# EAGLE schematic matchbox_cpu_v11 (EAGLE 7.2.0)
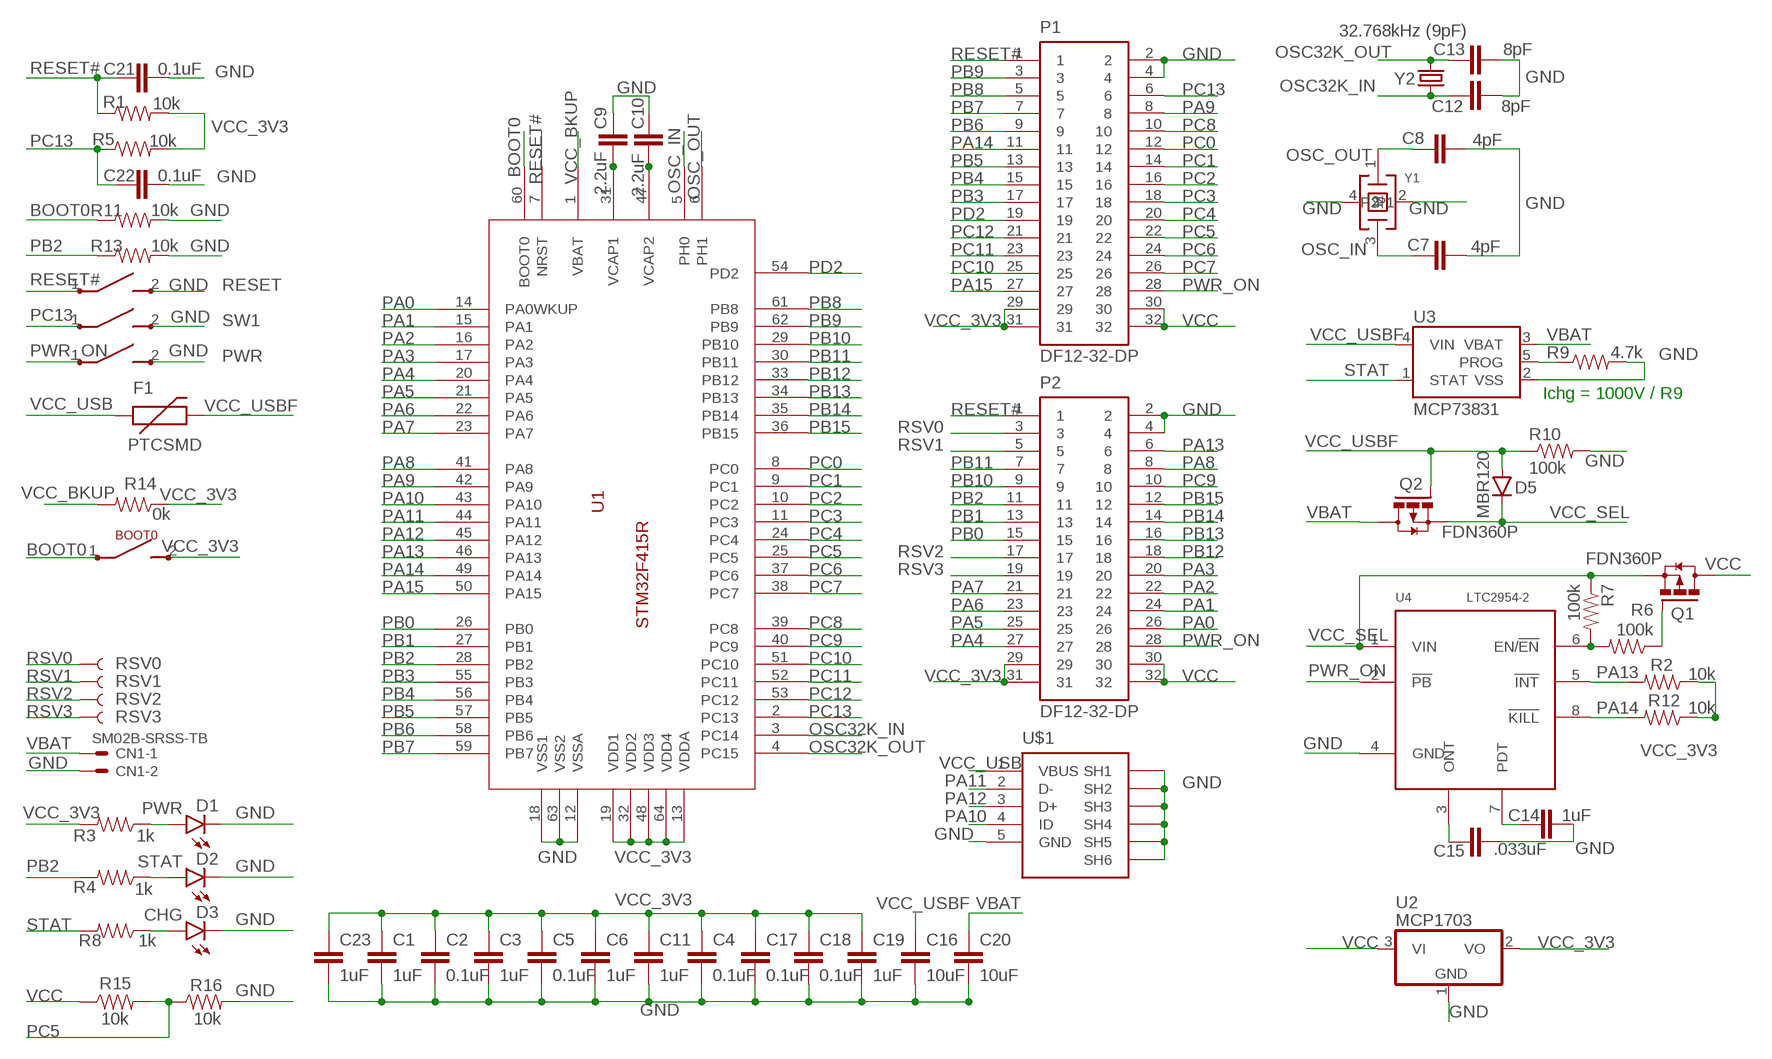
[diagram p0: schematic, sheet 1]

## Parts
BOOT0  B3U-3100PM-B  [B3U-3100PM-B]
C1  1uF  CAP0805  [0805]
C2  0.1uF  CAP0805  [0805]
C3  1uF  CAP0805  [0805]
C4  0.1uF  CAP0805  [0805]
C5  0.1uF  CAP0805  [0805]
C6  1uF  CAP0805  [0805]
C7  4pF  CAP0805  [0805]
C8  4pF  CAP0805  [0805]
C9  2.2uF  CAP0805  [0805]
C10  2.2uF  CAP0805  [0805]
C11  1uF  CAP0805  [0805]
C12  8pF  CAP0805  [0805]
C13  8pF  CAP0805  [0805]
C14  1uF  CAP0805  [0805]
C15  .033uF  CAP0805  [0805]
C16  10uF  CAP0805  [0805]
C17  0.1uF  CAP0805  [0805]
C18  0.1uF  CAP0805  [0805]
C19  1uF  CAP0805  [0805]
C20  10uF  CAP0805  [0805]
C21  0.1uF  CAP0805  [0805]
C22  0.1uF  CAP0805  [0805]
C23  1uF  CAP0805  [0805]
CN1  SM02B-SRSS-TB  [SM02B-SRSS-TB]
D1  PWR  LED0603  [LED-0603]
D2  STAT  LED0603  [LED-0603]
D3  CHG  LED0603  [LED-0603]
D5  MBR120  DIODESOD123  [SOD-123]
F1  PTCSMD  [PTC-1206]
P1  DF12-32-DP  AS-ITM-00015  [DF12-32-DP]
P2  DF12-32-DP  AS-ITM-00015  [DF12-32-DP]
PWR  B3U-3100PM-B  [B3U-3100PM-B]
Q1  FDN360P  [SUPER-SOT3]
Q2  FDN360P  [SUPER-SOT3]
R1  10k  RESISTOR0805-RES  [0805]
R2  10k  RESISTOR0805-RES  [0805]
R3  1k  RESISTOR0805-RES  [0805]
R4  1k  RESISTOR0805-RES  [0805]
R5  10k  RESISTOR0805-RES  [0805]
R6  100k  RESISTOR0805-RES  [0805]
R7  100k  RESISTOR0805-RES  [0805]
R8  1k  RESISTOR0805-RES  [0805]
R9  4.7k  RESISTOR0805-RES  [0805]
R10  100k  RESISTOR0805-RES  [0805]
R11  10k  RESISTOR0805-RES  [0805]
R12  10k  RESISTOR0805-RES  [0805]
R13  10k  RESISTOR0805-RES  [0805]
R14  0k  RESISTOR0805-RES  [0805]
R15  10k  RESISTOR0805-RES  [0805]
R16  10k  RESISTOR0805-RES  [0805]
RESET  B3U-3100PM-B  [B3U-3100PM-B]
RSV0  TEST-POINT3  [PAD.03X.03]
RSV1  TEST-POINT3  [PAD.03X.03]
RSV2  TEST-POINT3  [PAD.03X.03]
RSV3  TEST-POINT3  [PAD.03X.03]
SW1  B3U-3100PM-B  [B3U-3100PM-B]
U1  STM32F415R  STM32F4R_64PIN_FOXCAR  [LQFP64]
U2  MCP1703  [SOT23A]
U3  MCP73831  [SOT23-5]
U4  LTC2954-2  LTC2954  [SOT23-8]
U$1  MICROUSB  [MICROUSB]
Y1  16MHz(9pF)  AS-ITM-00228  [ABM11]
Y2  32.768kHz (9pF)  CRYSTALEPSONMC146  [CRYSTAL-32KHZ-SMD_EPSON_MC146]

## Nets
BOOT0: BOOT0.1 R11.1 U1.60(BOOT0)
GND: C1.2 C2.2 C3.2 C4.2 C5.2 C6.2 C7.2 C8.2 C9.1 C10.1 C11.2 C12.2 C13.2 C14.2 C15.2 C16.2 C17.2 C18.2 C19.2 C20.2 C21.2 C22.2 C23.2 CN1.2 D1.C D2.C D3.C P1.2 P1.4 P2.2 P2.4 PWR.2 R9.2 R10.2 R11.2 R13.2 R16.2 RESET.2 SW1.2 U1.12(VSSA) U1.18(VSS1) U1.63(VSS2) U2.1(GND) U3.2(VSS) U4.4(GND) U$1.5(GND) U$1.6(SH1) U$1.7(SH2) U$1.8(SH3) U$1.9(SH4) U$1.10(SH5) U$1.11(SH6) Y1.2 Y1.4(P1)
N$1: C9.2 U1.31(VCAP1)
N$2: C10.2 U1.47(VCAP2)
N$3: C15.1 U4.3(ONT)
N$4: C14.1 U4.7(PDT)
N$5: D1.A R3.1
N$6: D2.A R4.1
N$8: R6.2 R7.2 U4.6(EN/!EN!)
N$9: Q1.1(G) R6.1
N$10: D3.A R8.1
N$11: R9.1 U3.5(PROG)
OSC32K_IN: C12.1 U1.3(PC14) Y2.P$2
OSC32K_OUT: C13.1 U1.4(PC15) Y2.P$1
OSC_IN: C7.1 U1.5(PH0) Y1.3
OSC_OUT: C8.1 U1.6(PH1) Y1.1
PA0: P2.26 U1.14(PA0WKUP)
PA1: P2.24 U1.15(PA1)
PA2: P2.22 U1.16(PA2)
PA3: P2.20 U1.17(PA3)
PA4: P2.27 U1.20(PA4)
PA5: P2.25 U1.21(PA5)
PA6: P2.23 U1.22(PA6)
PA7: P2.21 U1.23(PA7)
PA8: P2.8 U1.41(PA8)
PA9: P1.8 U1.42(PA9)
PA10: U1.43(PA10) U$1.4(ID)
PA11: U1.44(PA11) U$1.2(D-)
PA12: U1.45(PA12) U$1.3(D+)
PA13: P2.6 R2.2 U1.46(PA13) U4.5(!INT!)
PA14: P1.11 R12.2 U1.49(PA14) U4.8(!KILL!)
PA15: P1.27 U1.50(PA15)
PB0: P2.15 U1.26(PB0)
PB1: P2.13 U1.27(PB1)
PB2: P2.11 R4.2 R13.1 U1.28(PB2)
PB3: P1.17 U1.55(PB3)
PB4: P1.15 U1.56(PB4)
PB5: P1.13 U1.57(PB5)
PB6: P1.9 U1.58(PB6)
PB7: P1.7 U1.59(PB7)
PB8: P1.5 U1.61(PB8)
PB9: P1.3 U1.62(PB9)
PB10: P2.9 U1.29(PB10)
PB11: P2.7 U1.30(PB11)
PB12: P2.18 U1.33(PB12)
PB13: P2.16 U1.34(PB13)
PB14: P2.14 U1.35(PB14)
PB15: P2.12 U1.36(PB15)
PC0: P1.12 U1.8(PC0)
PC1: P1.14 U1.9(PC1)
PC2: P1.16 U1.10(PC2)
PC3: P1.18 U1.11(PC3)
PC4: P1.20 U1.24(PC4)
PC5: P1.22 R15.2 R16.1 U1.25(PC5)
PC6: P1.24 U1.37(PC6)
PC7: P1.26 U1.38(PC7)
PC8: P1.10 U1.39(PC8)
PC9: P2.10 U1.40(PC9)
PC10: P1.25 U1.51(PC10)
PC11: P1.23 U1.52(PC11)
PC12: P1.21 U1.53(PC12)
PC13: C22.1 P1.6 R5.1 SW1.1 U1.2(PC13)
PD2: P1.19 U1.54(PD2)
PWR_ON: P1.28 P2.28 PWR.1 U4.2(!PB!)
RESET#: C21.1 P1.1 P2.1 R1.1 RESET.1 U1.7(NRST)
RSV0: P2.3 RSV0.P$1
RSV1: P2.5 RSV1.P$1
RSV2: P2.17 RSV2.P$1
RSV3: P2.19 RSV3.P$1
STAT: R8.2 U3.1(STAT)
VBAT: C20.1 CN1.1 Q2.3(D) U3.3(VBAT)
VCC: P1.30 P1.32 P2.30 P2.32 Q1.3(D) R15.1 U2.3(VI)
VCC_3V3: BOOT0.2 C1.1 C2.1 C3.1 C4.1 C5.1 C6.1 C11.1 C17.1 C18.1 C19.1 C23.1 P1.29 P1.31 P2.29 P2.31 R1.2 R2.1 R3.2 R5.2 R12.1 R14.1 U1.13(VDDA) U1.19(VDD1) U1.32(VDD2) U1.48(VDD3) U1.64(VDD4) U2.2(VO)
VCC_BKUP: R14.2 U1.1(VBAT)
VCC_SEL: D5.C Q1.2(S) Q2.2(S) R7.1 U4.1(VIN)
VCC_USB: F1.1 U$1.1(VBUS)
VCC_USBF: C16.1 D5.A F1.2 Q2.1(G) R10.1 U3.4(VIN)

## Notes on the sheet
- Ichg = 1000V / R9

## Power pins joined to a net without a drawn wire
GND: BOOT0.GND PWR.GND RESET.GND SW1.GND

## Library data of the parts
BOOT0 PWR RESET SW1 = sharp_display:B3U-3100PM-B
C1-C23 = SparkFun-Capacitors:CAP: Capacitor Standard 0603 ceramic capacitor, and 0.1" leaded capacitor.
CN1 = con-jst2:?M02B-SRSS-TB: Disconnectable Crimp style connector, 1.0mm pitch 2 contacts
D1-D3 = SparkFun-LED:LED: LEDs Standard schematic elements and footprints for 5mm, 3mm, 1206, and 0603 sized LEDs. 5mm - Spark Fun Electronics SKU : COM-00529 (and others)
D5 = SparkFun-DiscreteSemi:DIODE: Diode These are standard reverse protection diodes and small signal diodes. SMA package can handle up to about 1A. SOD-323 can handle about 200mA. What the SOD-323 package when ordering, there are some mfgs out there that are 5-pin packages.
F1 = SparkFun-PowerIC:PTC: Resettable Fuse PTC Resettable Fuse. Spark Fun Electronics SKU : COM-08357; PROD_ID: RES-11150
P1 P2 = micro1292:AS-ITM-00015: CONN HEADER 32POS 3MM SMD 0.5MM; PARTNO: AS-ITM-00015
Q1 Q2 = transistor-power:FDN360P: Single P-Channel, PowerTrench (R) MOSFET Source: http://www.fairchildsemi.com/ds/FD/FDN360P.pdf
R1-R16 = SparkFun-Passives:RESISTOR: Resistor Basic schematic elements and footprints for 0603, 1206, and PTH resistors.
RSV0 RSV1-RSV3 = SparkFun-Passives:TEST-POINT: Bare copper test points for troubleshooting or ICT
U1 = stm32f4:STM32F4R_64PIN_FOXCAR: 64-pin STM32F4 chip with symbol for Foxcar Control Board v1.
U2 = linear:MCP1703: 250 mA, 16V, Low Quiescent Current LDO Regulator Source: http://ww1.microchip.com/downloads/en/DeviceDoc/22049b.pdf
U3 = SparkFun-PowerIC:MCP73831: Miniature single cell, fully integrated Li-Ion, Li-polymer charge management controller http://ww1.microchip.com/downloads/en/DeviceDoc/20001984g.pdf IC-09995; PROD_ID: IC-09995
U4 = GeekAmmo:LTC2954: LTC2954 Push Button On/Off Controller with uP Interrupt The LTC®2954 is a pushbutton on/off controller that manages system power via a pushbutton interface. http://www.linear.com/docs/16598
U$1 = jimduino:MICROUSB
Y1 = micro1292:AS-ITM-00228: CRYSTAL 16MHZ 8PF SMD; PARTNO: AS-ITM-00228; VALUE: 8Y-16.000MAAV-T
Y2 = SparkFun-FreqCtrl:CRYSTAL: Various standard crystals. Proven footprints.